# EAGLE design zero_cross_fire_triac (EAGLE 9.0.0)

## Sheet 1 of 2
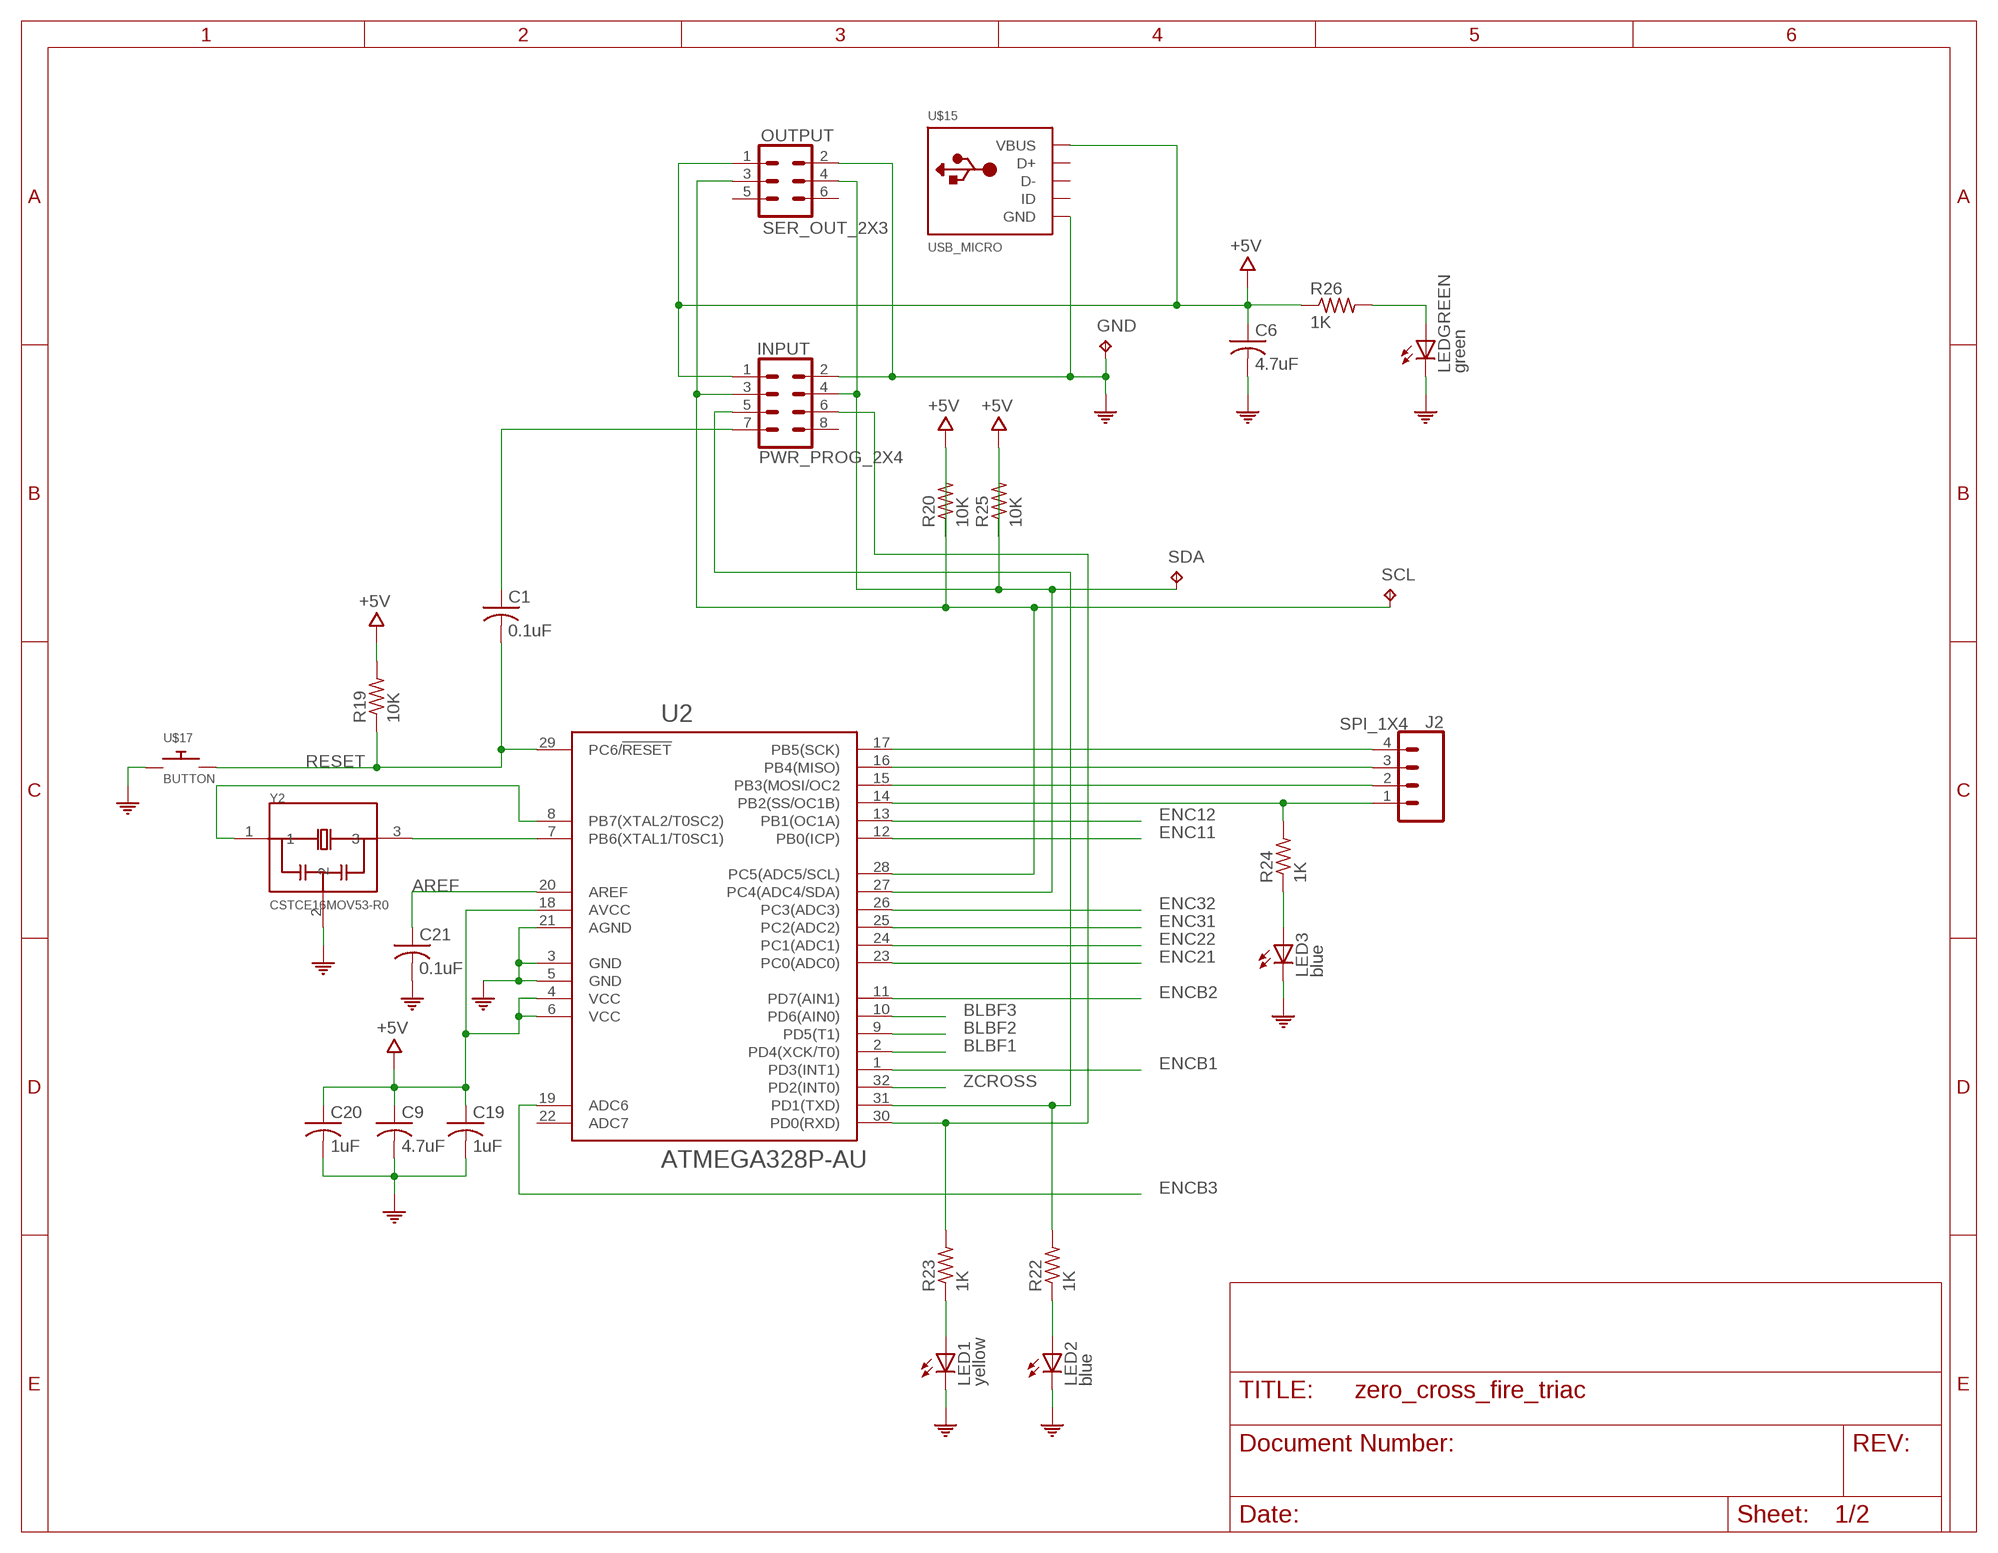
[diagram p0: schematic, sheet 1]

### Parts
C1  0.1uF  CAP_C2012X7R2A104K125AA  [C0805]
C6  4.7uF  CAP_C0805C475J4RACAUTO  [C0805]
C9  4.7uF  CAP_C0805C475J4RACAUTO  [C0805]
C19  1uF  CAP_CGA4J1X8R1E105M125AE  [C0805]
C20  1uF  CAP_CGA4J1X8R1E105M125AE  [C0805]
C21  0.1uF  CAP_C2012X7R2A104K125AA  [C0805]
GND  TEST_POINT  [TEST]
INPUT  PWR_PROG_2X4  [2X04]
J2  SPI_1X4  [1X04-BIG]
LED1  yellow  LED_APTD2012LSYCK  [LED1]
LED2  blue  LED_APTD2012LQBC  [LED1]
LED3  blue  LED_APTD2012LQBC  [LED1]
LEDGREEN  green  LED_APTD2012LZGCK  [LED1]
OUTPUT  SER_OUT_2X3  [2X03]
R19  10K  RESISTOR_RC0805JR-7W10KL  [R0805]
R20  10K  RESISTOR_RC0805JR-7W10KL  [R0805]
R22  1K  RESISTOR_RC0805JR-7W1KL  [R0805]
R23  1K  RESISTOR_RC0805JR-7W1KL  [R0805]
R24  1K  RESISTOR_RC0805JR-7W1KL  [R0805]
R25  10K  RESISTOR_RC0805JR-7W10KL  [R0805]
R26  1K  RESISTOR_RC0805JR-7W1KL  [R0805]
SCL  TEST_POINT  [TEST]
SDA  TEST_POINT  [TEST]
U2  ATMEGA328P-AU  [QFP80P900X900X120-32N]
U$15  USB_MICRO  [USB-MICRO-SMD-CUSTOM]
U$17  BUTTON  [PUSHBUTTON]
Y2  CSTCE16MOV53-R0  [OSC_CSTCE8M00G55-R0]

### Nets
+5V [VCC]: C6.1 C9.1 C19.1 C20.1 INPUT.1 OUTPUT.1 R19.2 R20.1 R25.1 R26.1 U2.4(VCC) U2.6(VCC) U2.18(AVCC) U$15.VBUS ; also sheet 2
AREF: C21.1 U2.20(AREF)
BLBF1: U2.2(PD4(XCK/T0)) ; also sheet 2
BLBF2: U2.9(PD5(T1)) ; also sheet 2
BLBF3: U2.10(PD6(AIN0)) ; also sheet 2
COM [GND]: C6.2 C9.2 C19.2 C20.2 C21.2 GND.1(TP) INPUT.2 LED1.1(C) LED2.1(C) LED3.1(C) LEDGREEN.1(C) OUTPUT.2 U2.3(GND) U2.5(GND) U2.21(AGND) U$15.GND U$15.SHIELD1(GND) U$15.SHIELD2(GND) U$15.SHIELD3(GND) U$17.1 U$17.2 Y2.2 ; also sheet 2
D0/RX: INPUT.6 R23.2 U2.30(PD0(RXD))
D1/TX: INPUT.5 R22.2 U2.31(PD1(TXD))
ENC11: U2.12(PB0(ICP)) ; also sheet 2
ENC12: U2.13(PB1(OC1A)) ; also sheet 2
ENC21: U2.23(PC0(ADC0)) ; also sheet 2
ENC22: U2.24(PC1(ADC1)) ; also sheet 2
ENC31: U2.25(PC2(ADC2)) ; also sheet 2
ENC32: U2.26(PC3(ADC3)) ; also sheet 2
ENCB1: U2.1(PD3(INT1)) ; also sheet 2
ENCB2: U2.11(PD7(AIN1)) ; also sheet 2
ENCB3: U2.19(ADC6) ; also sheet 2
N$1: U2.8(PB7(XTAL2/T0SC2)) Y2.1
N$2: J2.1 R24.2 U2.14(PB2(SS/OC1B))
N$3: LEDGREEN.2(A) R26.2
N$7: U2.7(PB6(XTAL1/T0SC1)) Y2.3
N$17: J2.2 U2.15(PB3(MOSI/OC2)
N$21: C1.1 INPUT.7
N$24: LED2.2(A) R22.1
N$25: J2.3 U2.16(PB4(MISO))
N$26: J2.4 U2.17(PB5(SCK))
N$27: LED1.2(A) R23.1
N$28: LED3.2(A) R24.1
RESET: C1.2 R19.1 U2.29(PC6/!RESET) U$17.3 U$17.4
SCL: INPUT.3 OUTPUT.3 R20.2 SCL.1(TP) U2.28(PC5(ADC5/SCL))
SDA [GND]: INPUT.4 OUTPUT.4 R25.2 SDA.1(TP) U2.27(PC4(ADC4/SDA))
ZCROSS: U2.32(PD2(INT0)) ; also sheet 2
Unconnected: INPUT.8 OUTPUT.5 OUTPUT.6 U2.22(ADC7) U$15.D+ U$15.D- U$15.ID

## Sheet 2 of 2
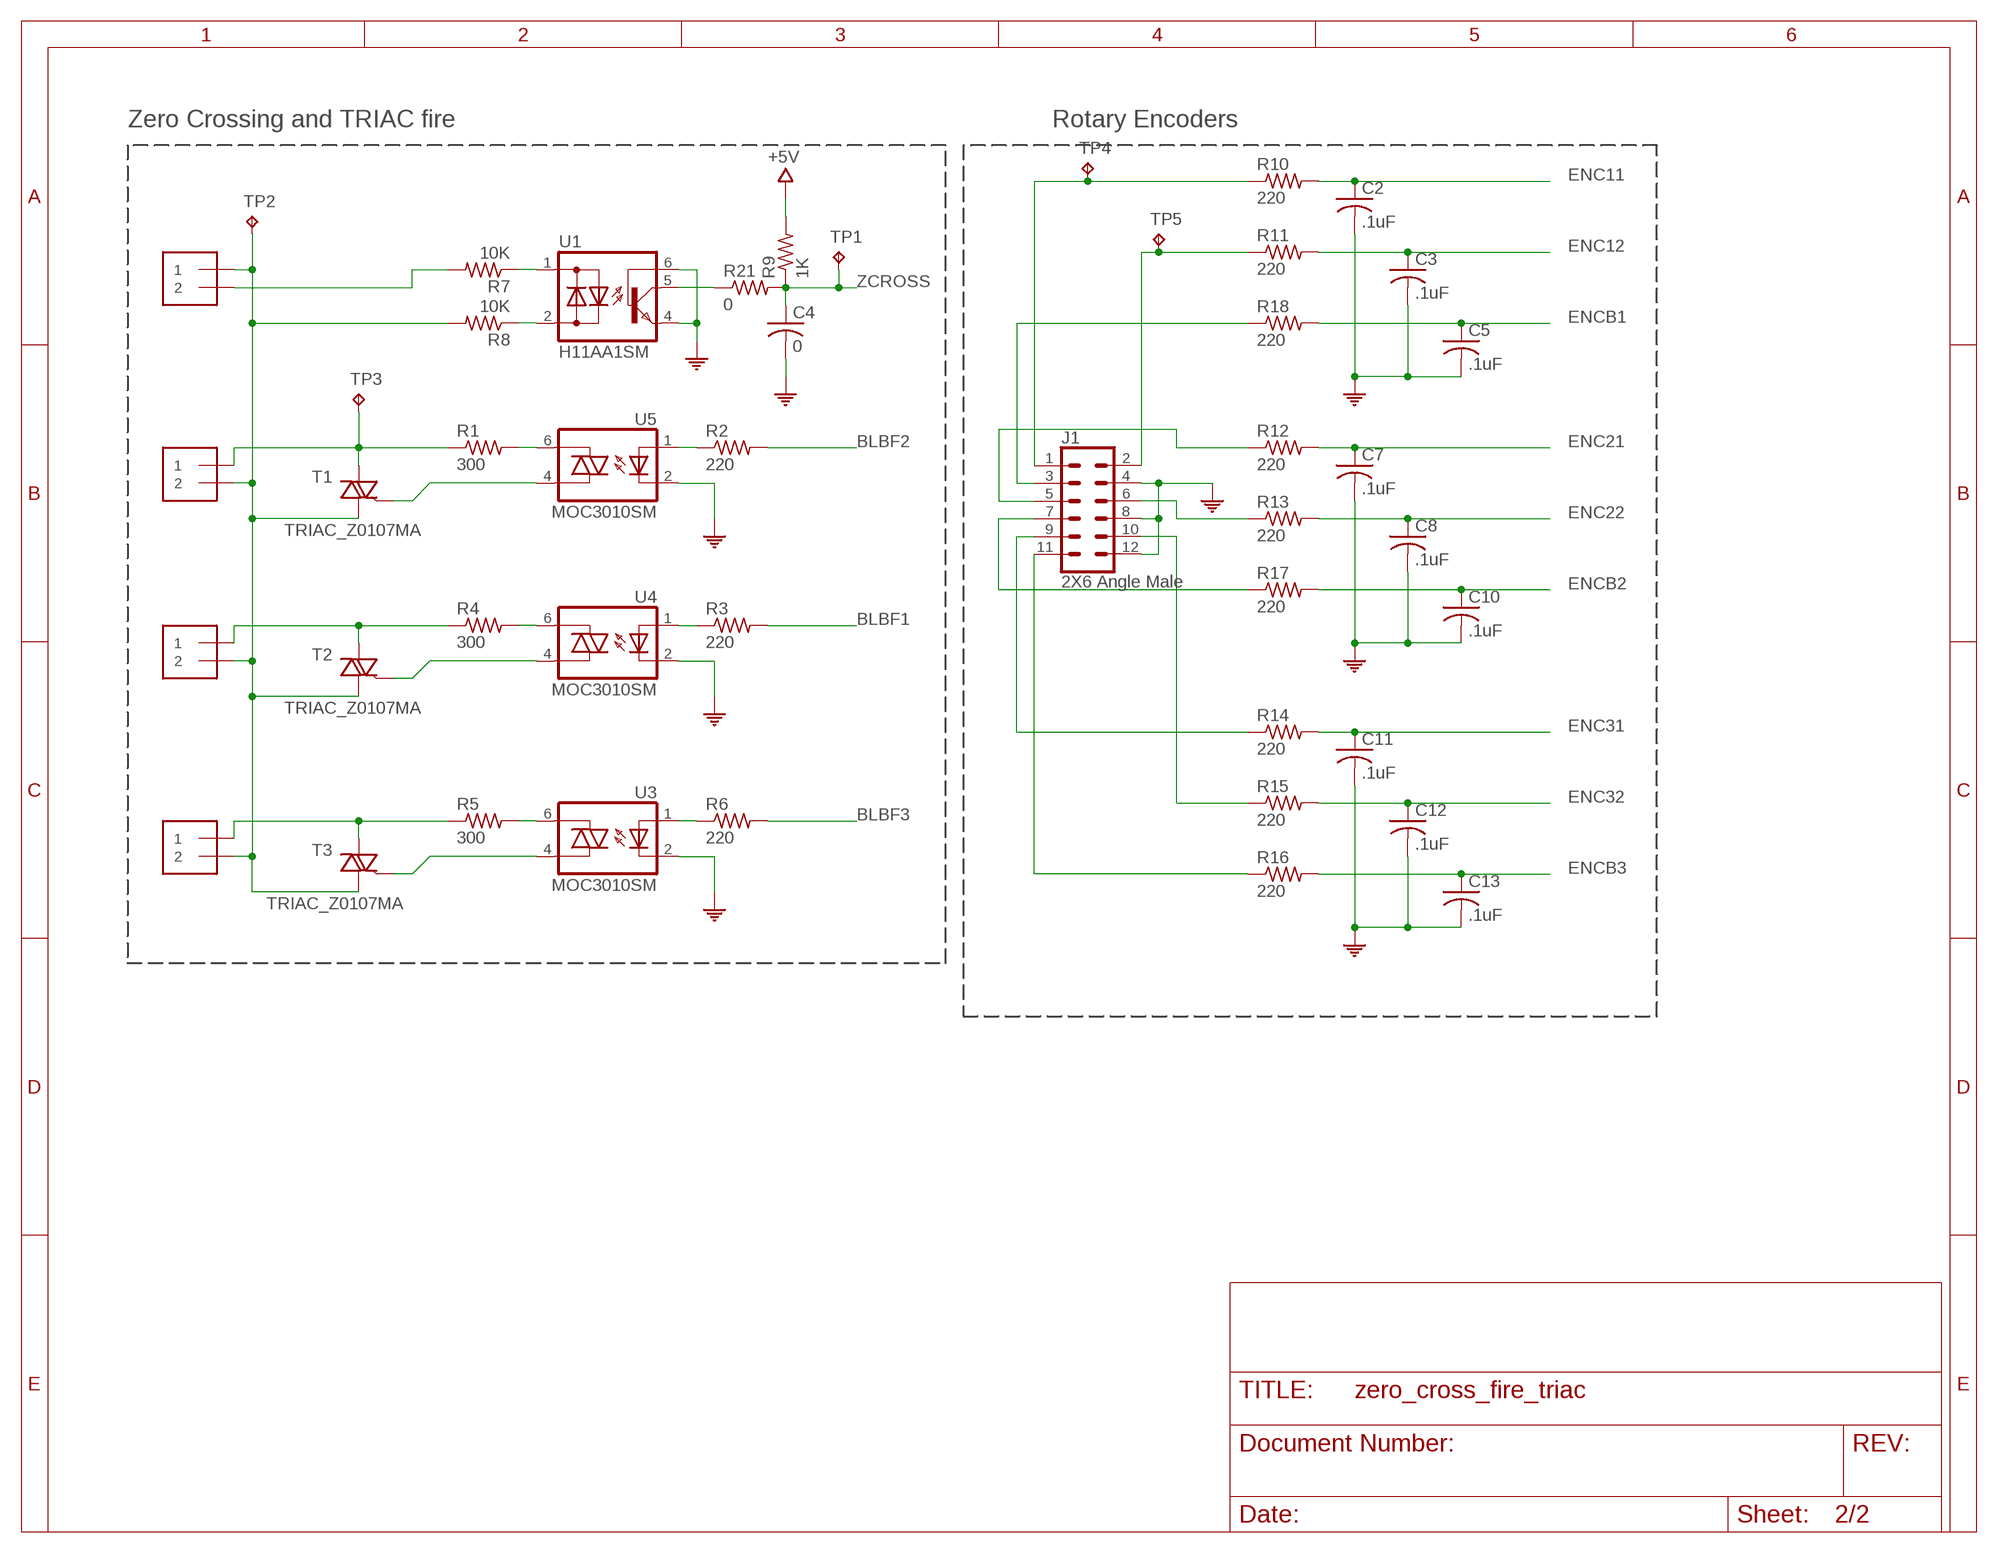
[diagram p1: schematic, sheet 2]

### Parts
BLB1  SCREW_BLOCK_2PIN  [1X2-200MIL]
BLB2  SCREW_BLOCK_2PIN  [1X2-200MIL]
BLB3  SCREW_BLOCK_2PIN  [1X2-200MIL]
C2  .1uF  CAP_C2012X7R2A104K125AA  [C0805]
C3  .1uF  CAP_C2012X7R2A104K125AA  [C0805]
C4  0  CAP_C2012X7R2A104K125AA  [C0805]
C5  .1uF  CAP_C2012X7R2A104K125AA  [C0805]
C7  .1uF  CAP_C2012X7R2A104K125AA  [C0805]
C8  .1uF  CAP_C2012X7R2A104K125AA  [C0805]
C10  .1uF  CAP_C2012X7R2A104K125AA  [C0805]
C11  .1uF  CAP_C2012X7R2A104K125AA  [C0805]
C12  .1uF  CAP_C2012X7R2A104K125AA  [C0805]
C13  .1uF  CAP_C2012X7R2A104K125AA  [C0805]
J1  2X6 Angle Male  ROT_ENCODE_2X6  [2X06]
MAIN  SCREW_BLOCK_2PIN  [1X2-200MIL]
R1  300  RESISTOR_KTR25JZPF3000  [R1210]
R2  220  RESISTOR_ESR10EZPF  [R0805]
R3  220  RESISTOR_ESR10EZPF  [R0805]
R4  300  RESISTOR_KTR25JZPF3000  [R1210]
R5  300  RESISTOR_KTR25JZPF3000  [R1210]
R6  220  RESISTOR_ESR10EZPF  [R0805]
R7  10K  RESISTOR_LTR50UZPJ  [RLTR50]
R8  10K  RESISTOR_LTR50UZPJ  [RLTR50]
R9  1K  RESISTOR_RC0805JR-7W1KL  [R0805]
R10  220  RESISTOR_ESR10EZPF  [R0805]
R11  220  RESISTOR_ESR10EZPF  [R0805]
R12  220  RESISTOR_ESR10EZPF  [R0805]
R13  220  RESISTOR_ESR10EZPF  [R0805]
R14  220  RESISTOR_ESR10EZPF  [R0805]
R15  220  RESISTOR_ESR10EZPF  [R0805]
R16  220  RESISTOR_ESR10EZPF  [R0805]
R17  220  RESISTOR_ESR10EZPF  [R0805]
R18  220  RESISTOR_ESR10EZPF  [R0805]
R21  0  RESISTOR_ESR10EZPF  [R0805]
T1  TRIAC_Z0107MA  [TO92]
T2  TRIAC_Z0107MA  [TO92]
T3  TRIAC_Z0107MA  [TO92]
TP1  TEST_POINT  [TEST]
TP2  TEST_POINT  [TEST]
TP3  TEST_POINT  [TEST]
TP4  TEST_POINT  [TEST]
TP5  TEST_POINT  [TEST]
U1  H11AA1SM  [DIL6-SMD]
U3  MOC3010SM  [DIL6-SMD]
U4  MOC3010SM  [DIL6-SMD]
U5  MOC3010SM  [DIL6-SMD]

### Nets
+5V [VCC]: R9.2 ; also sheet 1
BLBF1: R3.2 ; also sheet 1
BLBF2: R2.2 ; also sheet 1
BLBF3: R6.2 ; also sheet 1
COM [GND]: C2.2 C3.2 C4.2 C5.2 C7.2 C8.2 C10.2 C11.2 C12.2 C13.2 J1.4 J1.8 J1.12 U1.4(E) U1.6(B) U3.2(C) U4.2(C) U5.2(C) ; also sheet 1
ENC11: C2.1 R10.2 ; also sheet 1
ENC12: C3.1 R11.2 ; also sheet 1
ENC21: C7.1 R12.2 ; also sheet 1
ENC22: C8.1 R13.2 ; also sheet 1
ENC31: C11.1 R14.2 ; also sheet 1
ENC32: C12.1 R15.2 ; also sheet 1
ENCB1: C5.1 R18.2 ; also sheet 1
ENCB2: C10.1 R17.2 ; also sheet 1
ENCB3: C13.1 R16.2 ; also sheet 1
MAINNUETRAL [main_neutral]: BLB1.1 BLB2.1 BLB3.1 MAIN.2 R8.P$2 T1.1(A1) T2.1(A1) T3.1(A1) TP2.1(TP)
N$4 [main_hot]: BLB3.2 R5.1 T3.3(A2)
N$5 [main_hot]: R5.2 U3.6(A2)
N$6: R6.1 U3.1(A)
N$8 [main_hot]: BLB1.2 R4.1 T2.3(A2)
N$9 [main_hot]: R4.2 U4.6(A2)
N$10: R3.1 U4.1(A)
N$11 [main_hot]: BLB2.2 R1.1 T1.3(A2) TP3.1(TP)
N$12: R2.1 U5.1(A)
N$13 [main_hot]: R8.P$1 U1.2(AC2)
N$14: J1.1 R10.1 TP4.1(TP)
N$15 [main_hot]: MAIN.1 R7.P$2
N$16 [main_hot]: R7.P$1 U1.1(AC1)
N$18 [main_hot]: R1.2 U5.6(A2)
N$19 [main_hot]: T1.2(G) U5.4(A1)
N$20 [main_hot]: T2.2(G) U4.4(A1)
N$22 [main_hot]: T3.2(G) U3.4(A1)
N$23: R21.1 U1.5(C)
N$30: J1.3 R18.1
N$31: J1.5 R12.1
N$32: J1.7 R17.1
N$33: J1.9 R14.1
N$34: J1.11 R16.1
N$35: J1.2 R11.1 TP5.1(TP)
N$38: J1.6 R13.1
N$41: J1.10 R15.1
ZCROSS: C4.1 R9.1 R21.2 TP1.1(TP) ; also sheet 1

### Notes on the sheet
- Zero Crossing and TRIAC fire | Rotary Encoders

## Library data of the parts
BLB1-BLB3 MAIN = myparts_201805:SCREW_BLOCK_2PIN: screw block 2 pin
C1-C5 C7 C8 C10-C13 C21 = myparts_201805:CAP_C2012X7R2A104K125AA: Multilayer Ceramic Capacitors MLCC - SMD/SMT 0805 100V 0.1uF X7R 10% T: 1.25mm; AVAILABILITY: good; DESCRIPTION: Multilayer Ceramic Capacitors MLCC - SMD/SMT 0805 100V 0.1uF X7R 10% T: 1.25mm; MF: TDK; MP: C2012X7R2A104K125AA; PACKAGE: SMD 0805; PRICE: 0.081
C6 C9 = myparts_201805:CAP_C0805C475J4RACAUTO: Multilayer Ceramic Capacitors MLCC - SMD/SMT 16volts 4.7uF 5% X7R AUTO; AVAILABILITY: New Product: New from this manufacturer.; DESCRIPTION: Multilayer Ceramic Capacitors MLCC - SMD/SMT 16volts 4.7uF 5% X7R AUTO; MF: KEMET; MP: C0805C475J4RACAUTO; PACKAGE: SMD 0805; PRICE: 0.312
C19 C20 = myparts_201805:CAP_CGA4J1X8R1E105M125AE: Multilayer Ceramic Capacitors MLCC - SMD/SMT 0805 25V 1.00uF X8R 20% AEC-Q200; AVAILABILITY: New Product: New from this manufacturer.; DESCRIPTION: Multilayer Ceramic Capacitors MLCC - SMD/SMT 0805 25V 1.00uF X8R 20% AEC-Q200; MF: TDK; MP: CGA4J1X8R1E105M125AE; PACKAGE: 0805; PRICE: 0.32
GND SCL SDA TP1-TP5 = myparts_201805:TEST_POINT: Circuit Board Hardware - PCB TEST POINT SMD; AVAILABILITY: good; DESCRIPTION: Circuit Board Hardware - PCB TEST POINT SMD; MF: Keystone Electronics; MP: 5016; PACKAGE: SMD; PRICE: .35
INPUT = myparts_201805:PWR_PROG_2X4: 2x4 angle break away for power; AVAILABILITY: Adafruit good; DESCRIPTION: 2x4 connection power angle; MF: Adafruit; MP: 2x4; PACKAGE: 2x4 break away; PRICE: 1
J1 = myparts_201805:ROT_ENCODE_2X6: 2X6 mail connector break away; AVAILABILITY: adafruit; DESCRIPTION: Angle Connector; MF: Adafruit; MP: 2X6 angle; PACKAGE: break away; PRICE: 1.00
J2 = myparts_201805:SPI_1X4: 1x4 male break away; AVAILABILITY: adafruit; DESCRIPTION: SPI connector; MF: adafruit; MP: 1x4; PACKAGE: 1x4 break away; PRICE: 0.4
LED1 = myparts_201805:LED_APTD2012LSYCK: Standard LEDs - SMD 0805 Dome Lens LED Yellow- 590nm; AVAILABILITY: New Product: New from this manufacturer.; DESCRIPTION: Standard LEDs - SMD 0805 Dome Lens LED Yellow- 590nm; MF: Kingbright; MP: APTD2012LSYCK; PACKAGE: SMD 0805; PRICE: 0.205
LED2 LED3 = myparts_201805:LED_APTD2012LQBC: Standard LEDs - SMD 0805 Dome Lens LED Blue- 465nm; AVAILABILITY: New Product: New from this manufacturer.; DESCRIPTION: Standard LEDs - SMD 0805 Dome Lens LED Blue- 465nm; MF: Kingbright; MP: APTD2012LQBC/D; PACKAGE: 0805; PRICE: 0.293
LEDGREEN = myparts_201805:LED_APTD2012LZGCK: Standard LEDs - SMD 0805 Dome Lens LED Green- 525nm; AVAILABILITY: New Product: New from this manufacturer.; DESCRIPTION: Standard LEDs - SMD 0805 Dome Lens LED Green- 525nm; MF: Kingbright; MP: APTD2012LZGCK; PACKAGE: SMD 0805; PRICE: 0.433
OUTPUT = myparts_201805:SER_OUT_2X3: 2x3 Female angle break away for serial and power to next board; AVAILABILITY: adafruit good; DESCRIPTION: female 2x3 ouput serial; MF: adafruit; MP: 2x3 female break away; PACKAGE: female 2x3 break away; PRICE: .70
R1 R4 R5 = myparts_201805:RESISTOR_KTR25JZPF3000: Thick Film Resistors - SMD 1210 300ohm 1% High Voltage; AVAILABILITY: New Product: New from this manufacturer.; DESCRIPTION: Thick Film Resistors - SMD 1210 300ohm 1% High Voltage; MF: ROHM Semiconductor; MP: KTR25JZPF3000; PACKAGE: SMD 1210; PRICE: 0.231
R2 R3 R6 R10-R18 R21 = myparts_201805:RESISTOR_ESR10EZPF: Thick Film Resistors - SMD 0805 220ohm 1% Anti Surge AEC-Q200; AVAILABILITY: New Product: New from this manufacturer.; DESCRIPTION: Thick Film Resistors - SMD 0805 220ohm 1% Anti Surge AEC-Q200; MF: ROHM Semiconductor; MP: ESR10EZPF2200; PACKAGE: SMD 0805; PRICE: 0.142
R7 R8 = myparts_201805:RESISTOR_LTR50UZPJ: Thick Film Resistors - SMD 1020 10Kohm 5% Rev Term AEC-Q200; AVAILABILITY: New Product; DESCRIPTION: Thick Film Resistors - SMD 1020 10Kohm 5% Rev Term AEC-Q200; MF: ROHM Semiconductor; MP: LTR50UZPJ103; PACKAGE: 1020; PRICE: 0.30
R9 R22-R24 R26 = myparts_201805:RESISTOR_RC0805JR-7W1KL: Thick Film Resistors - SMD; AVAILABILITY: good; DESCRIPTION: Thick Film Resistors - SMD; MF: Yageo; MP: RC0805JR-7W1KL; PACKAGE: SMD 0805; PRICE: 0.09
R19 R20 R25 = myparts_201805:RESISTOR_RC0805JR-7W10KL: Thick Film Resistors - SMD; AVAILABILITY: good; DESCRIPTION: Thick Film Resistors - SMD; MF: Yageo; MP: RC0805JR-7W10KL; PACKAGE: SMD 0805; PRICE: 0.09
T1-T3 = myparts_201805:TRIAC_Z0107MA: Triacs 1.0 Amp 600 Volt; AVAILABILITY: good; DESCRIPTION: Triacs 1.0 Amp 600 Volt; MF: STMicroelectronics; MP: Z0107MA 5AL2; PACKAGE: TO-92; PRICE: 0.529
U1 = myparts_201805:H11AA1SM: Transistor Output Optocouplers MOT AC IN-TRANS OUT; AVAILABILITY: good; DESCRIPTION: Transistor Output Optocouplers MOT AC IN-TRANS OUT; MF: ON Semiconductor / Fairchild; MP: H11AA1SM; PACKAGE: SMD-DIP-6; PRICE: 0.75
U2 = myparts_201805:ATMEGA328P-AU: ATmega Series 16 MHz 32 KB Flash 2 KB SRAM 8-Bit Microcontroller - TQFP-32; AVAILABILITY: Good; DESCRIPTION: 8-bit Microcontrollers - MCU 32KB In-system Flash 20MHz 1.8V-5.5V; MF: Microchip; MP: ATMEGA328P-AU; PACKAGE: TQFP-32 Microchip; PRICE: 2.22
U3-U5 = myparts_201805:MOC3010SM: Triac & SCR Output Optocouplers SO-6 NON-ZERO TRIAC; AVAILABILITY: good; DESCRIPTION: Triac & SCR Output Optocouplers SO-6 NON-ZERO TRIAC; MF: ON Semiconductor / Fairchild; MP: MOC3010SM; PACKAGE: SMD-DIP-6; PRICE: 0.82
U$15 = myparts_201805:USB_MICRO: Pcs Micro USB Type B Female Socket 180 Degree 5-Pin SMD SMT Solder Connector
U$17 = myparts_201805:BUTTON: Description: Pushbutton Switches 50mA 12VDC F065 7.0mm J-Lead; AVAILABILITY: good; DESCRIPTION: Pushbutton Switches 50mA 12VDC F065 7.0mm J-Lead; MF: E-Switch; MP: LL3301FF065QJ; PACKAGE: SMD TL3301; PRICE: 0.54
Y2 = myparts_201805:CSTCE16MOV53-R0: Resonators 16MHz .5% CHIP; AVAILABILITY: End of Life: Scheduled for obsolescence and will be discontinued by the manufacturer.; DESCRIPTION: Resonator 16MHz .5% CHIP; MF: Murata Electronics; MP: CSTCE16M0V53-R0; PACKAGE: Non-Standard; PRICE: 0.343

## Net classes
0 default: width 0.254 mm, clearance 0.254 mm
1 main_neutral: width 0.61 mm, clearance 0.381 mm
2 main_hot: width 0.61 mm, clearance 0.381 mm
3 VCC: width 0.305 mm, clearance 0.254 mm
4 GND: width 0.381 mm, clearance 0.254 mm

## Board
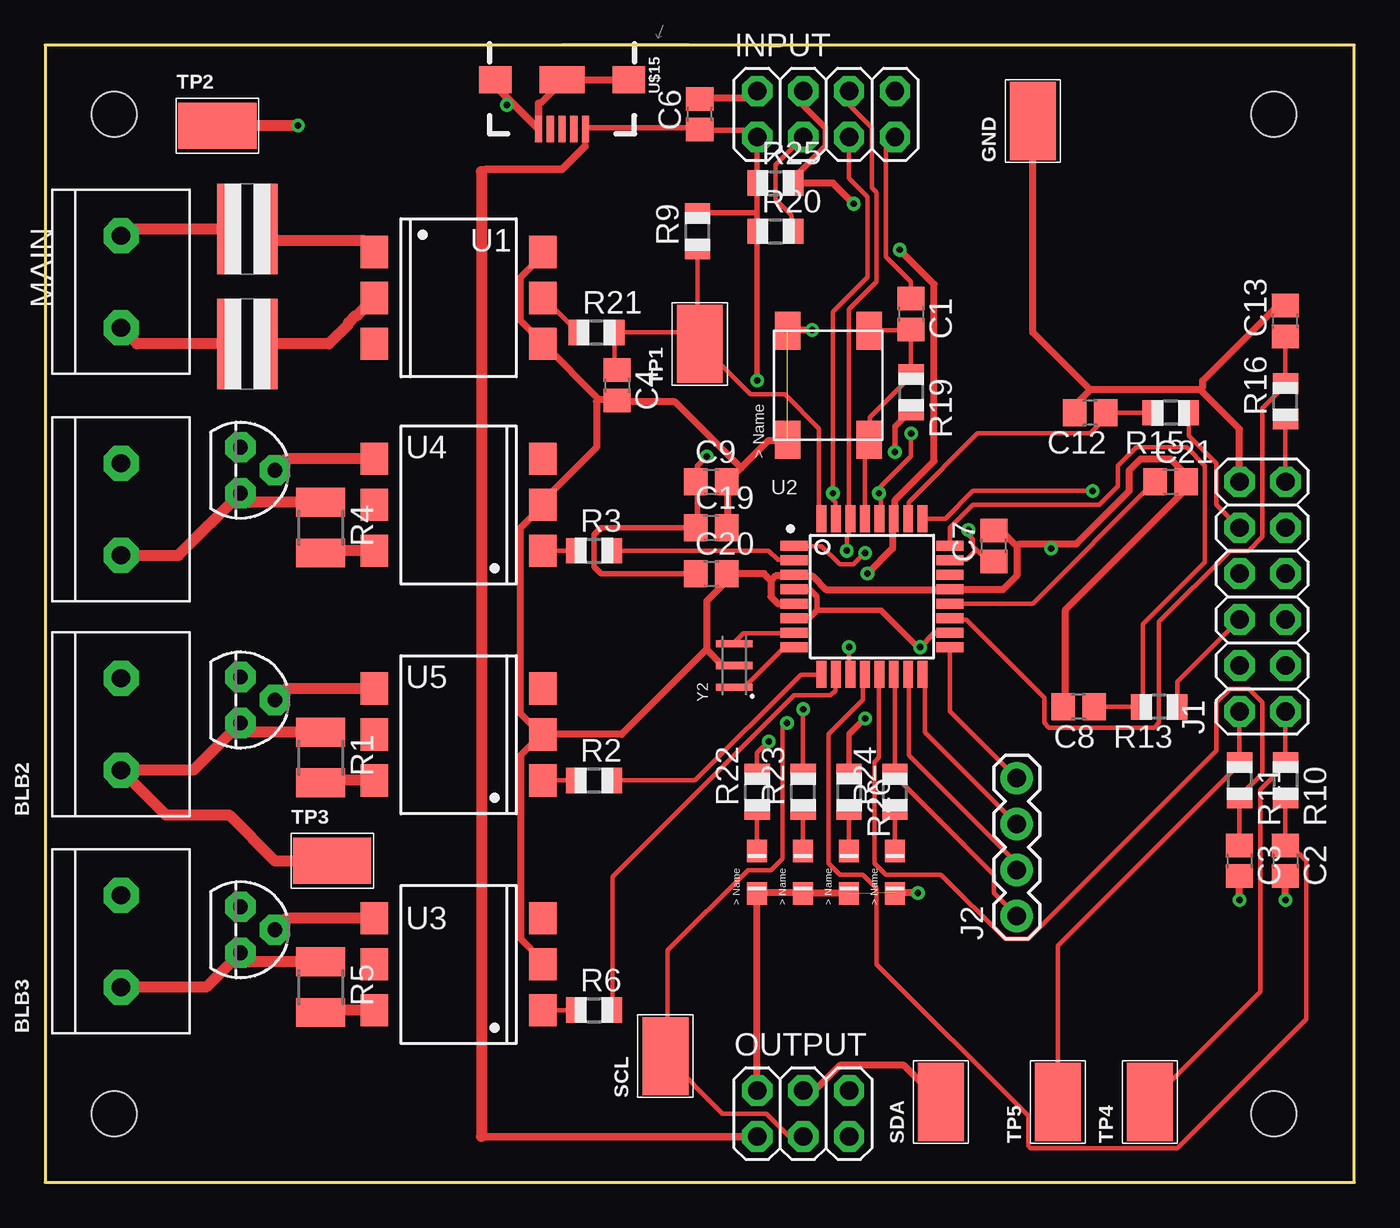
[diagram p2: board, top side]
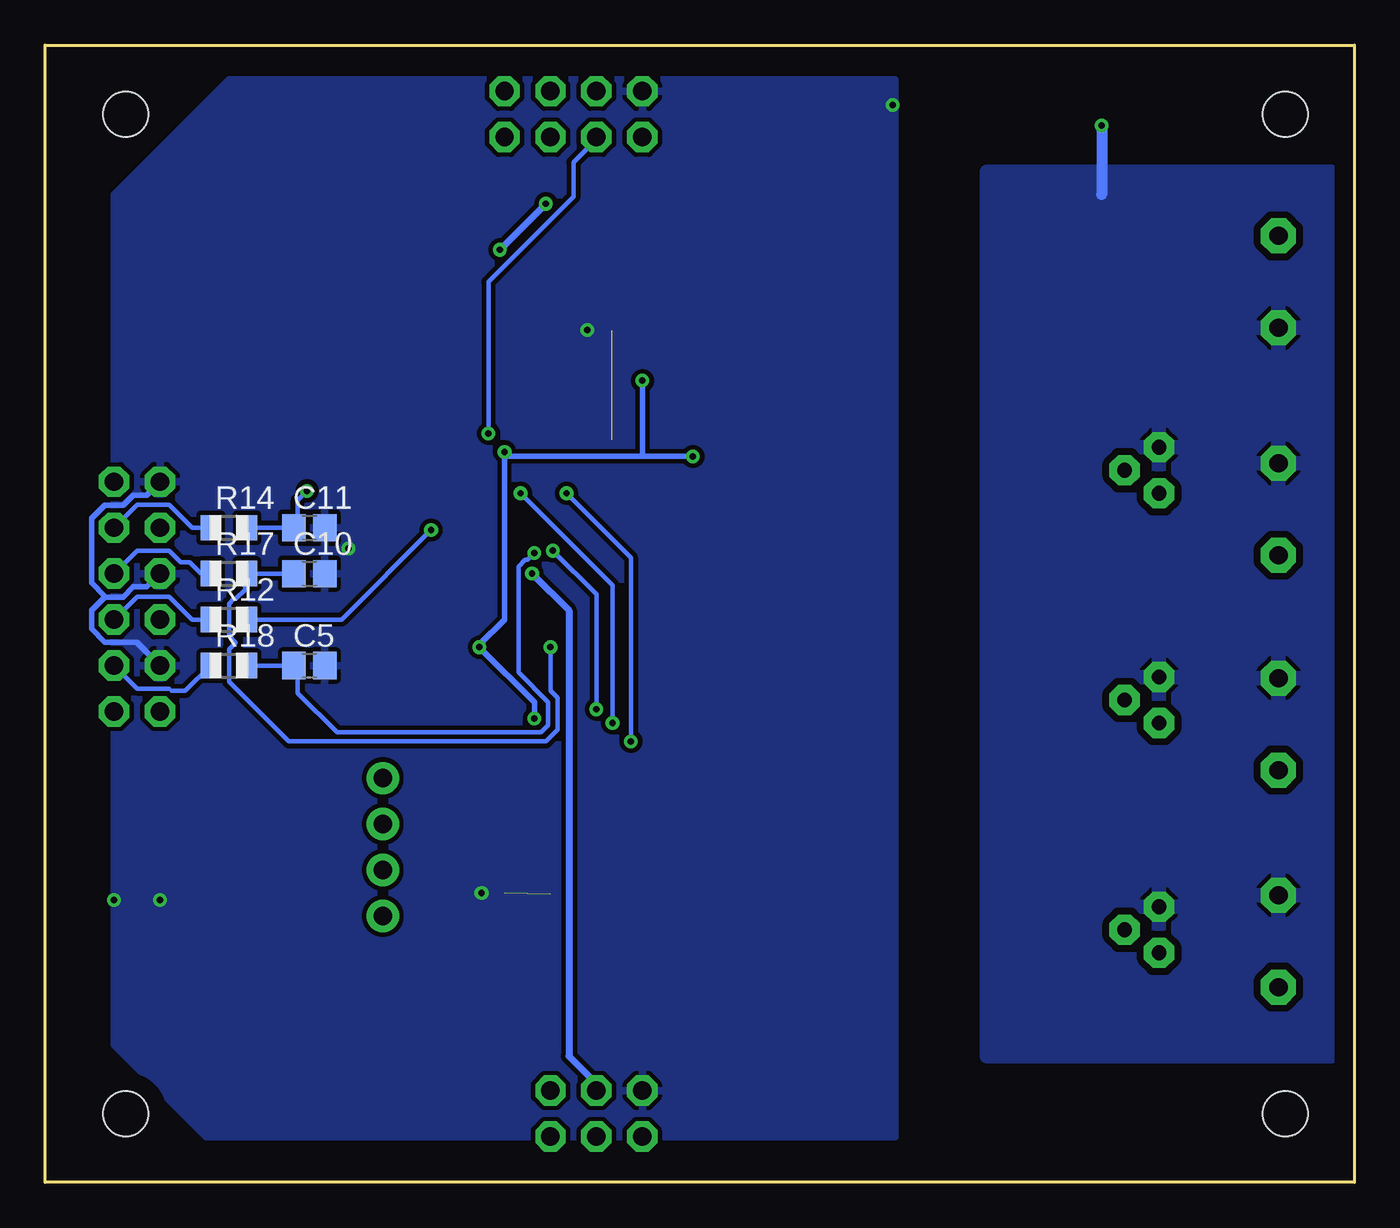
[diagram p3: board, bottom side, seen from below]

Size 72.39 x 62.86 mm. Coordinates in mm from the lower left corner, seen from the top.
Outline: 0,62.86 0,0 72.39,0 72.39,62.86 0,62.86
Copper layers (1*16): Top 0.035mm / dielectric 1.5mm / Bottom 0.035mm
Design rules "default *": minimum track width 6mil, minimum drill 0.35mm, track to track 6mil, track to pad 6mil, pad to pad 6mil, via to via 6mil, smd to smd 6mil, copper to edge 40mil, drill to drill 6mil, minimum pad ring 10mil, minimum via ring 8mil, stop-mask expansion 4mil, vias tented up to drill 0mil, thermal gap 10mil
Holes 2.5 mm at 3.81,3.81 67.94,3.81 67.94,59.05 3.81,59.05

### Footprints (pad centres in the part's own frame; a part is rotated, then mirrored left to right if it is on the bottom)
1X2-200MIL = drill 1 pad 1.93 octagon: 1 2.54,0; 2 -2.54,0
C0805 = smd 1.3 x 1.5: 1 -0.85,0; 2 0.85,0
TEST = smd 4.318 x 2.54: 1 0,0
2X04 = drill 1.016 pad 1.676 octagon: 1 -3.81,-1.27; 2 -3.81,1.27; 3 -1.27,-1.27; 4 -1.27,1.27; 5 1.27,-1.27; 6 1.27,1.27; 7 3.81,-1.27; 8 3.81,1.27
2X06 = drill 1.016 pad 1.676 octagon: 1 -3.81,-1.27; 2 -3.81,1.27; 3 -1.27,-1.27; 4 -1.27,1.27; 5 1.27,-1.27; 6 1.27,1.27; 7 3.81,-1.27; 8 3.81,1.27; 9 6.35,-1.27; 10 6.35,1.27; 11 8.89,-1.27; 12 8.89,1.27
1X04-BIG = drill 1.016 pad 1.778: 1 0,0; 2 2.54,0; 3 5.08,0; 4 7.62,0
LED1 = smd 1.25 x 1.1: 1 -1.175,0; 2 1.175,0
2X03 = drill 1.016 pad 1.676 octagon: 1 -3.81,-1.27; 2 -3.81,1.27; 3 -1.27,-1.27; 4 -1.27,1.27; 5 1.27,-1.27; 6 1.27,1.27
R1210 = smd 1.6 x 2.7: 1 -1.4,0; 2 1.4,0
R0805 = smd 1.1 x 1.4: 1 -1,0; 2 1,0
RLTR50 = smd 1.3 x 5: P$1 1.025,0; P$2 -1.025,0
TO92 = drill 0.813 pad 1.676 octagon: 1 -1.27,0; 2 0,1.905; 3 1.27,0
DIL6-SMD = smd 1.78 x 1.52: 1 -2.54,-4.645; 2 0,-4.645; 3 2.54,-4.645; 4 2.54,4.645; 5 0,4.645; 6 -2.54,4.645
QFP80P900X900X120-32N = smd 1.5 x 0.55: 1 -4.3,2.8; 2 -4.3,2; 3 -4.3,1.2; 4 -4.3,0.4; 5 -4.3,-0.4; 6 -4.3,-1.2; 7 -4.3,-2; 8 -4.3,-2.8; 17 4.3,-2.8; 18 4.3,-2; 19 4.3,-1.2; 20 4.3,-0.4; 21 4.3,0.4; 22 4.3,1.2; 23 4.3,2; 24 4.3,2.8 | smd 0.55 x 1.5: 9 -2.8,-4.3; 10 -2,-4.3; 11 -1.2,-4.3; 12 -0.4,-4.3; 13 0.4,-4.3; 14 1.2,-4.3; 15 2,-4.3; 16 2.8,-4.3; 25 2.8,4.3; 26 2,4.3; 27 1.2,4.3; 28 0.4,4.3; 29 -0.4,4.3; 30 -1.2,4.3; 31 -2,4.3; 32 -2.8,4.3
USB-MICRO-SMD-CUSTOM = smd 1.45 x 0.4: D+ 2.725,0; D- 2.725,0.65; GND 2.725,-1.3; ID 2.725,-0.65; VBUS 2.725,1.3 | smd 1.5 x 1.8: SHIELD1 0,3.685; SHIELD2 0,-3.685 | smd 1.5 x 2.5: SHIELD3 0,0
PUSHBUTTON = smd 2.1 x 1.4: 1 -3,2.25; 2 3,2.25; 3 -3,-2.25; 4 3,-2.25
OSC_CSTCE8M00G55-R0 = smd 0.4 x 2: 1 -1.2,0; 2 0,0; 3 1.2,0

### Placement (x,y rotation side)
BLB1  4.19,37.21 90 top
BLB2  4.19,25.34 90 top
BLB3  4.19,13.34 90 top
C1  47.88,48.01 270 top
C2  68.58,17.78 270 top
C3  66.04,17.78 270 top
C4  31.62,44.07 270 top
C5  57.78,28.58 0 bottom
C6  36.2,59.05 90 top
C7  52.45,35.18 90 top
C8  57.15,26.29 180 top
C9  36.83,38.73 0 top
C10  57.78,33.66 0 bottom
C11  57.78,36.2 0 bottom
C12  57.78,42.55 180 top
C13  68.58,47.62 90 top
C19  36.83,36.2 0 top
C20  36.83,33.66 0 top
C21  62.23,38.73 0 top
GND  54.61,58.67 90 top
INPUT  43.18,59.05 0 top
J1  67.31,29.84 90 top
J2  53.72,14.73 90 top
LED1  41.91,17.14 90 top
LED2  39.37,17.14 90 top
LED3  46.99,17.14 90 top
LEDGREEN  44.45,17.14 90 top
MAIN  4.19,49.78 90 top
OUTPUT  43.18,3.81 0 top
R1  15.24,23.49 270 top
R2  30.35,22.22 0 top
R3  30.35,34.92 0 top
R4  15.24,36.2 270 top
R5  15.24,10.79 270 top
R6  30.35,9.52 0 top
R7  11.18,52.7 0 top
R8  11.18,46.35 0 top
R9  36.07,52.58 90 top
R10  68.58,22.22 270 top
R11  66.04,22.22 270 top
R12  62.23,31.12 0 bottom
R13  61.59,26.29 180 top
R14  62.23,36.2 0 bottom
R15  62.23,42.55 180 top
R16  68.58,43.18 90 top
R17  62.23,33.66 0 bottom
R18  62.23,28.58 0 bottom
R19  47.88,43.69 270 top
R20  40.39,52.58 0 top
R21  30.48,46.99 0 top
R22  39.37,21.59 90 top
R23  41.91,21.59 90 top
R24  46.99,21.59 90 top
R25  40.39,55.25 0 top
R26  44.45,21.59 270 top
SCL  34.29,6.98 90 top
SDA  49.53,4.45 90 top
T1  10.79,26.67 270 top
T2  10.79,39.37 270 top
T3  10.79,13.97 270 top
TP1  36.2,46.35 90 top
TP2  9.53,58.42 0 top
TP3  15.88,17.78 0 top
TP4  61.09,4.45 90 top
TP5  56.01,4.45 90 top
U1  22.86,48.89 270 top
U2  45.72,32.38 0 top
U3  22.86,12.06 90 top
U4  22.86,37.46 90 top
U5  22.86,24.77 90 top
U$15  28.57,60.96 270 top
U$17  43.31,44.07 90 top
Y2  38.1,28.58 90 top

### Tracks (layer width: path | path; a pad name or v marks a point on that pad's centre or on a via)
+5V  (via drill 0.35)
  Top 0.305: C20.1 30.73,33.66 30.35,34.04 30.35,35.81 30.73,36.2 C19.1 36.07,36.32 36.07,38.73 C9.1 36.07,38.86 36.07,39.62 v36.58,40.13 | 42.67,31.62 42.29,31.24 41.53,31.24 U2.6 | 42.67,31.62 42.67,32.38 42.29,32.77 41.53,32.77 U2.4 | R26.1 44.45,24.77 v45.34,25.65 | U2.18 49.91,30.35 49.15,30.35 v48.39,29.59 48.26,29.59 46.23,31.62 42.67,31.62 | v46.99,40.39 46.99,41.78 47.88,42.67 R19.2 | 39.37,53.59 39.37,55.25 R25.1 39.37,55.37 INPUT.1 39.24,57.78 38.86,58.17 36.32,58.17 C6.1 36.2,58.29 29.97,58.29 U$15.VBUS 29.84,58.17 29.84,57.28 | 39.37,53.59 39.37,52.58 R20.1 39.37,52.45 v39.37,44.32 | 39.37,53.59 36.07,53.59 R9.2 | 24.38,56.01 24.13,55.88
  Top 0.406: 24.13,2.54 OUTPUT.1 | 29.84,57.28 28.57,56.01 24.38,56.01
  Top 0.61: 24.13,55.88 24.13,2.54
  Bottom 0.305: v45.34,25.65 45.34,26.54 v48.39,29.59 48.39,29.72 46.99,31.12 v46.99,40.39 46.86,40.13 39.37,40.13 | 39.37,40.13 v36.58,40.13 | v39.37,44.32 39.37,40.13
AREF
  Top 0.254: U2.20 50.04,32 54.61,32 61.34,38.73 C21.1
BLBF1
  Top 0.254: R3.2 40.01,34.92 40.51,34.42 41.4,34.42 U2.2
BLBF2
  Top 0.254: R2.2 35.94,22.22 41.78,28.07 42.8,28.07 U2.9
BLBF3
  Top 0.254: R6.2 31.37,9.52 31.37,16.89 41.4,26.92 43.43,26.92 43.69,27.18 43.69,28.07 U2.10
COM  (via drill 0.35)  (2 unrouted)
  Top 0.381: C19.2 37.72,36.2 37.72,38.73 C9.2 37.85,38.86 38.48,39.5 | 38.48,39.5 40.01,41.02 41.02,41.02 U$17.1 | 30.61,43.31 31.62,43.31 C4.2 31.75,43.18 34.8,43.18 38.48,39.5 | 30.61,43.31 27.56,46.35 U1.4 27.43,46.48 26.29,47.62 26.29,50.04 27.43,51.18 27.43,51.44 U1.6 | 30.61,43.31 30.48,43.18 30.48,40.64 27.56,37.72 27.56,37.46 U4.2 27.43,37.34 26.29,36.2 26.29,25.91 27.3,24.89 U5.2 | C8.2 56.39,26.29 56.39,31.62 62.99,38.23 62.99,38.73 C21.2 62.87,38.86 62.87,39.37 62.23,40.01 60.58,40.01 59.94,39.37 59.94,38.23 57.02,35.31 55.63,35.31 | U3.2 27.43,12.06 27.43,12.32 26.29,13.46 26.29,23.62 27.43,24.77 U5.2 | 53.72,35.18 53.72,33.53 52.96,32.77 50.04,32.77 U2.21 49.91,32.77 43.18,32.77 42.42,33.53 41.53,33.53 U2.3 41.4,33.53 40.39,33.53 40.13,33.27 | 53.72,35.18 52.96,35.94 52.45,35.94 C7.2 | 40.13,33.27 40.13,32.38 40.51,32 41.4,32 U2.5 | 40.13,33.27 39.75,33.66 C20.2 37.59,33.53 37.59,33.15 36.58,32.13 36.58,29.46 | Y2.2 37.47,28.58 36.58,29.46 | U5.2 31.88,24.77 36.58,29.46 | 55.63,35.31 53.85,35.31 53.72,35.18 | LEDGREEN.1 44.45,16 42.04,16 LED1.1 41.91,16 39.37,16 LED2.1 OUTPUT.2 | v48.26,16 46.99,16 LED3.1 | U$15.GND 27.18,58.29 27.19,58.31 | 27.27,59.65 27.43,59.69 28.57,60.83 U$15.SHIELD3 U$15.SHIELD1 | v25.53,59.56 25.53,59.69 25.67,59.83 | v66.04,15.62 C3.2 | v68.58,15.62 C2.2 | INPUT.2 38.99,59.94 36.2,59.94 C6.2 | 57.78,43.81 57.02,43.05 57.02,42.55 C12.2 | 63.88,43.81 57.78,43.81 | 63.88,43.81 66.04,41.66 J1.12 | C13.2 68.58,48.39 68.07,48.39 64.01,44.32 64.01,43.94 63.88,43.81 | v42.42,47.12 41.15,47.12 U$17.2 | GND.1 54.61,46.99 57.78,43.81 | v55.63,35.05 55.63,35.31
  Top 0.406: 27.27,59.65 U$15.GND 27.19,58.31 25.67,59.83 24.89,60.61 U$15.SHIELD2
  Bottom 0.305: 69.1,32.36 69.83,31.63 69.83,30.6 69.1,29.87 67.33,29.87 J1.4 | 69.1,32.36 68.09,32.36 67.53,32.92 66.78,32.92 J1.8 | J1.12 66.78,38 67.53,38 68.09,37.44 69.1,37.44 69.83,36.71 69.83,33.14 69.1,32.41 69.1,32.36
  pour Bottom: 25.4,55.88 25.4,2.54 63.5,2.54 68.58,7.62 68.58,8.89 68.58,54.61 62.23,60.96 25.4,60.96
D0/RX  (via drill 0.35)
  Top 0.254: v41.91,26.16 R23.2 | v44.32,34.92 44.32,35.69 44.45,35.81 44.45,36.58 U2.30 44.45,36.7 44.45,48.26 45.97,49.78 45.97,54.74 45.72,54.99 45.72,58.29 44.45,59.56 INPUT.6
  Bottom 0.254: v41.91,26.16 41.91,32.51 v44.32,34.92
D1/TX  (via drill 0.35)
  Top 0.254: R22.2 39.37,23.75 v40.01,24.38 | U2.31 43.69,36.7 43.69,37.59 43.56,37.72 v43.56,38.1 43.56,48.13 45.47,50.04 45.47,54.48 44.45,55.5 INPUT.5
  Bottom 0.254: v40.01,24.38 40.01,34.54 v43.56,38.1
ENC11
  Top 0.254: R10.2 C2.1 68.58,18.54 68.96,18.54 69.72,17.78 69.72,9.02 62.61,1.9 54.48,1.9 54.36,2.03 54.36,3.68 45.97,12.06 45.97,16.26 45.21,17.02 43.94,17.02 43.31,17.65 43.31,24.77 45.21,26.67 45.21,28.07 U2.12
ENC12
  Top 0.254: C3.1 R11.2 66.04,21.34 67.31,22.61 67.31,26.54 66.55,27.3 65.53,27.3 64.77,26.54 64.77,23.88 54.36,13.46 53.09,13.46 49.53,17.02 46.48,17.02 45.85,17.65 45.85,23.24 46.1,23.49 46.1,28.07 U2.13
ENC21  (via drill 0.35)
  Top 0.254: v51.05,36.07 51.05,35.81 51.31,35.56 51.31,35.18 51.5,34.99 | 51.5,34.99 52.07,34.42 52.45,34.42 C7.1 | 51.5,34.99 50.93,34.42 50.04,34.42 U2.23
  Bottom 0.254: R12.2 56.01,31.12 v51.05,36.07
ENC22
  Top 0.254: C8.1 R13.2 60.71,26.29 60.71,30.86 64.14,34.29 64.14,39.62 63.12,40.64 60.33,40.64 59.31,39.62 59.31,38.48 58.29,37.46 51.31,37.46 50.04,36.2 50.04,35.31 U2.24
ENC31  (via drill 0.35)
  Top 0.254: v57.91,38.23 51.31,38.23 49.78,36.7 48.64,36.7 U2.25
  Bottom 0.254: R14.2 C11.1 58.55,36.2 58.42,36.32 58.42,37.72 v57.91,38.23
ENC32
  Top 0.254: R15.2 C12.1 58.55,42.55 58.55,42.16 57.78,41.4 51.56,41.4 47.75,37.59 47.75,36.7 U2.26
ENCB1  (via drill 0.35)
  Top 0.254: v45.34,34.8 44.7,34.16 43.94,34.16 42.93,35.18 41.53,35.18 U2.1
  Bottom 0.254: R18.2 C5.1 58.55,28.58 58.42,28.45 58.42,27.05 56.26,24.89 44.96,24.89 44.58,25.27 44.58,26.54 46.23,28.19 46.23,34.04 45.85,34.42 45.72,34.42 v45.34,34.8
ENCB2  (via drill 0.35)
  Top 0.254: v44.45,29.59 44.45,28.19 U2.11
  Bottom 0.254: C10.1 R17.2 61.34,33.66 61.34,32.77 61.85,32.26 61.98,32.26 62.23,32 62.23,30.23 61.85,29.84 62.23,29.46 62.23,27.69 58.93,24.38 44.7,24.38 44.07,25.02 44.07,26.8 44.45,27.18 v44.45,29.59
ENCB3
  Top 0.254: C13.1 R16.2 68.58,44.07 67.31,42.8 67.31,35.69 66.55,34.92 65.53,34.92 61.59,30.99 61.59,25.4 61.34,25.15 55.5,25.15 55.24,25.4 55.24,26.8 50.93,31.12 50.04,31.12 U2.19
MAINNUETRAL  (via drill 0.35)
  Top 0.61: v13.97,58.42 TP2.1 | R8.P$2 5.08,46.35 MAIN.2
  Bottom 0.61: v13.97,58.42 13.97,54.61
  pour Bottom: 1.27,55.88 20.32,55.88 20.32,6.98 1.27,6.98
N$1
  Top 0.254: U2.8 41.4,29.46 40.77,29.46 38.73,27.43 38.1,27.43 Y2.1
N$2
  Top 0.254: U2.14 46.99,28.07 R24.2 46.99,22.48 52.45,17.02 52.45,16 J2.1
N$3
  Top 0.254: R26.2 LEDGREEN.2
N$4
  Top 0.61: R5.1 11.3,12.2 T3.3 8.89,10.79 BLB3.2
N$5
  Top 0.61: U3.6 15.37,9.52 R5.2
N$6
  Top 0.254: U3.1 R6.1
N$7
  Top 0.254: U2.7 41.4,30.35 38.61,30.35 38.1,29.84 Y2.3
N$8
  Top 0.61: R4.1 11.3,37.59 T2.3 7.37,34.67 BLB1.2
N$9
  Top 0.61: U4.6 15.37,34.92 R4.2
N$10
  Top 0.254: U4.1 R3.1
N$11
  Top 0.61: R1.1 11.3,24.89 T1.3 8.19,22.8 BLB2.2 6.67,20.32 10.16,20.32 12.7,17.78 TP3.1
N$12
  Top 0.254: U5.1 R2.1
N$13
  Top 0.61: R8.P$1 15.68,46.35 16.77,47.45 16.77,47.53 17.17,47.93 17.25,47.93 U1.2
N$14
  Top 0.254: J1.1 R10.1 68.58,23.11 67.18,21.72 67.18,10.54 TP4.1
N$15
  Top 0.61: R7.P$2 4.57,52.7 MAIN.1
N$16
  Top 0.61: U1.1 17.58,52.07 12.7,52.07 12.57,52.32 R7.P$1
N$17
  Top 0.254: J2.2 53.72,17.65 47.75,23.62 47.75,28.07 U2.15
N$18
  Top 0.61: U5.6 15.37,22.22 R1.2
N$19
  Top 0.61: U5.4 13.34,27.3 T1.2
N$20
  Top 0.61: U4.4 13.34,40.01 T2.2
N$21
  Top 0.254: C1.1 47.88,49.78 46.48,51.18 46.48,57.28 INPUT.7
N$22
  Top 0.61: U3.4 13.34,14.61 T3.2
N$23
  Top 0.254: R21.1 29.46,46.99 27.56,48.89 U1.5
N$24
  Top 0.254: R22.1 LED2.2
N$25
  Top 0.254: J2.3 48.64,24.89 48.64,28.07 U2.16
N$26
  Top 0.254: J2.4 50.04,26.03 50.04,29.46 U2.17
N$27
  Top 0.254: R23.1 LED1.2
N$28
  Top 0.254: R24.1 LED3.2
N$30
  Bottom 0.254: J1.3 67.31,27.3 65.53,27.3 65.41,27.18 64.64,27.18 63.25,28.58 R18.1
N$31
  Bottom 0.254: R12.1 64.26,31.12 65.53,32.38 67.31,32.38 J1.5
N$32
  Bottom 0.254: R17.1 63.75,33.66 64.39,34.29 64.9,34.29 65.53,34.92 67.31,34.92 J1.7
N$33
  Bottom 0.254: R14.1 64.26,36.2 65.53,37.46 67.31,37.46 J1.9
N$34
  Top 0.254: J1.11 R16.1
N$35
  Top 0.254: J1.2 R11.1 66.04,23.11 56.01,13.08 TP5.1
N$38
  Top 0.254: J1.6 62.61,27.69 62.61,26.29 R13.1
N$41
  Top 0.254: J1.10 64.77,37.46 64.77,39.75 63.25,41.27 63.25,42.55 R15.1
RESET
  Top 0.254: 47.88,47.12 R19.1 47.88,44.58 45.59,42.29 45.59,41.15 U$17.3 45.47,41.02 45.34,40.89 45.34,36.7 U2.29 | 47.88,47.12 45.59,47.12 U$17.4 | 47.88,47.12 C1.2
SCL  (via drill 0.35)
  Top 0.254: OUTPUT.3 41.15,2.54 39.88,3.81 37.47,3.81 SCL.1 34.42,6.98 34.42,12.83 38.86,17.27 40.13,17.27 40.77,17.91 40.77,25.15 v41.02,25.4 | INPUT.3 40.39,56.26 40.39,54.36 41.27,53.47 41.27,52.58 R20.2 | 46.23,38.1 46.23,38.48 47.88,40.13 v47.88,41.4 | 46.23,38.1 46.23,36.7 U2.28 | 46.23,38.1 v46.1,38.1
  Bottom 0.254: v47.88,41.4 47.88,49.78 43.18,54.48 43.18,56.39 41.91,57.66 INPUT.3 | v41.02,25.4 41.02,33.02 v46.1,38.1
SDA  (via drill 0.35)
  Top 0.305: INPUT.4 41.91,59.55 43.16,58.3 43.16,57.27 41.39,55.5 R25.2
  Top 0.381: OUTPUT.4 42.55,5.08 43.94,6.48 47.5,6.48 SDA.1 | R25.2 43.56,55.25 v44.7,54.1 | v47.24,51.56 49.15,49.66 49.15,39.88 46.99,37.72 46.99,36.7 U2.27 46.86,36.58 46.86,35.05 v45.47,33.66
  Bottom 0.381: v47.24,51.56 v44.7,54.1 | OUTPUT.4 41.91,5.46 43.43,6.98 43.43,31.62 v45.47,33.66
ZCROSS
  Top 0.254: 31.5,46.99 31.5,45.09 31.62,44.96 C4.1 | 36.07,46.99 36.07,46.48 TP1.1 | 36.07,46.99 R9.1 | TP1.1 38.99,43.56 40.89,43.56 42.8,41.66 42.8,36.7 U2.32 | 36.07,46.99 31.5,46.99 | 31.5,46.99 R21.2 | 36.07,46.99 TP1.1